# Altium schematic sheet [16] - DOC, POWER SEQUENCING.SchDoc
size A2; DocumentNumber: 16; SheetNumber: 16; SheetTotal: 18
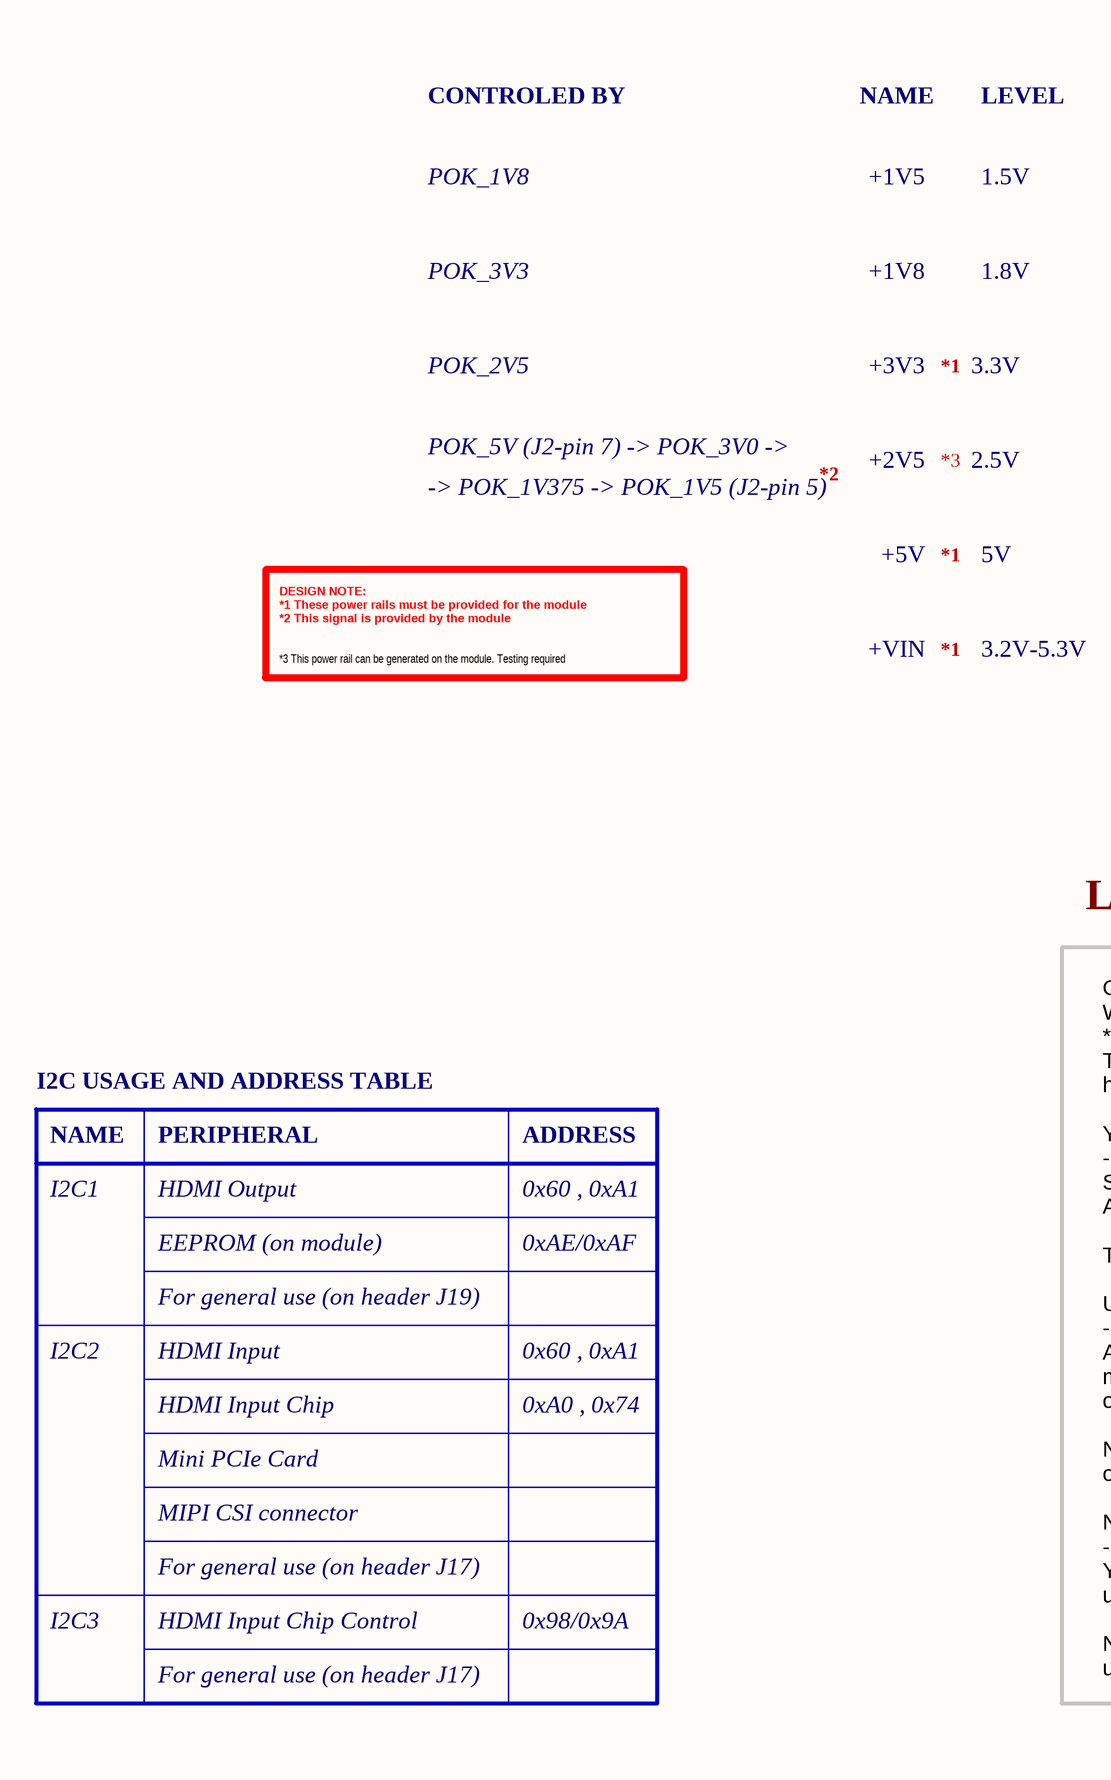
[diagram p0: [16] - DOC, POWER SEQUENCING.SchDoc, left]
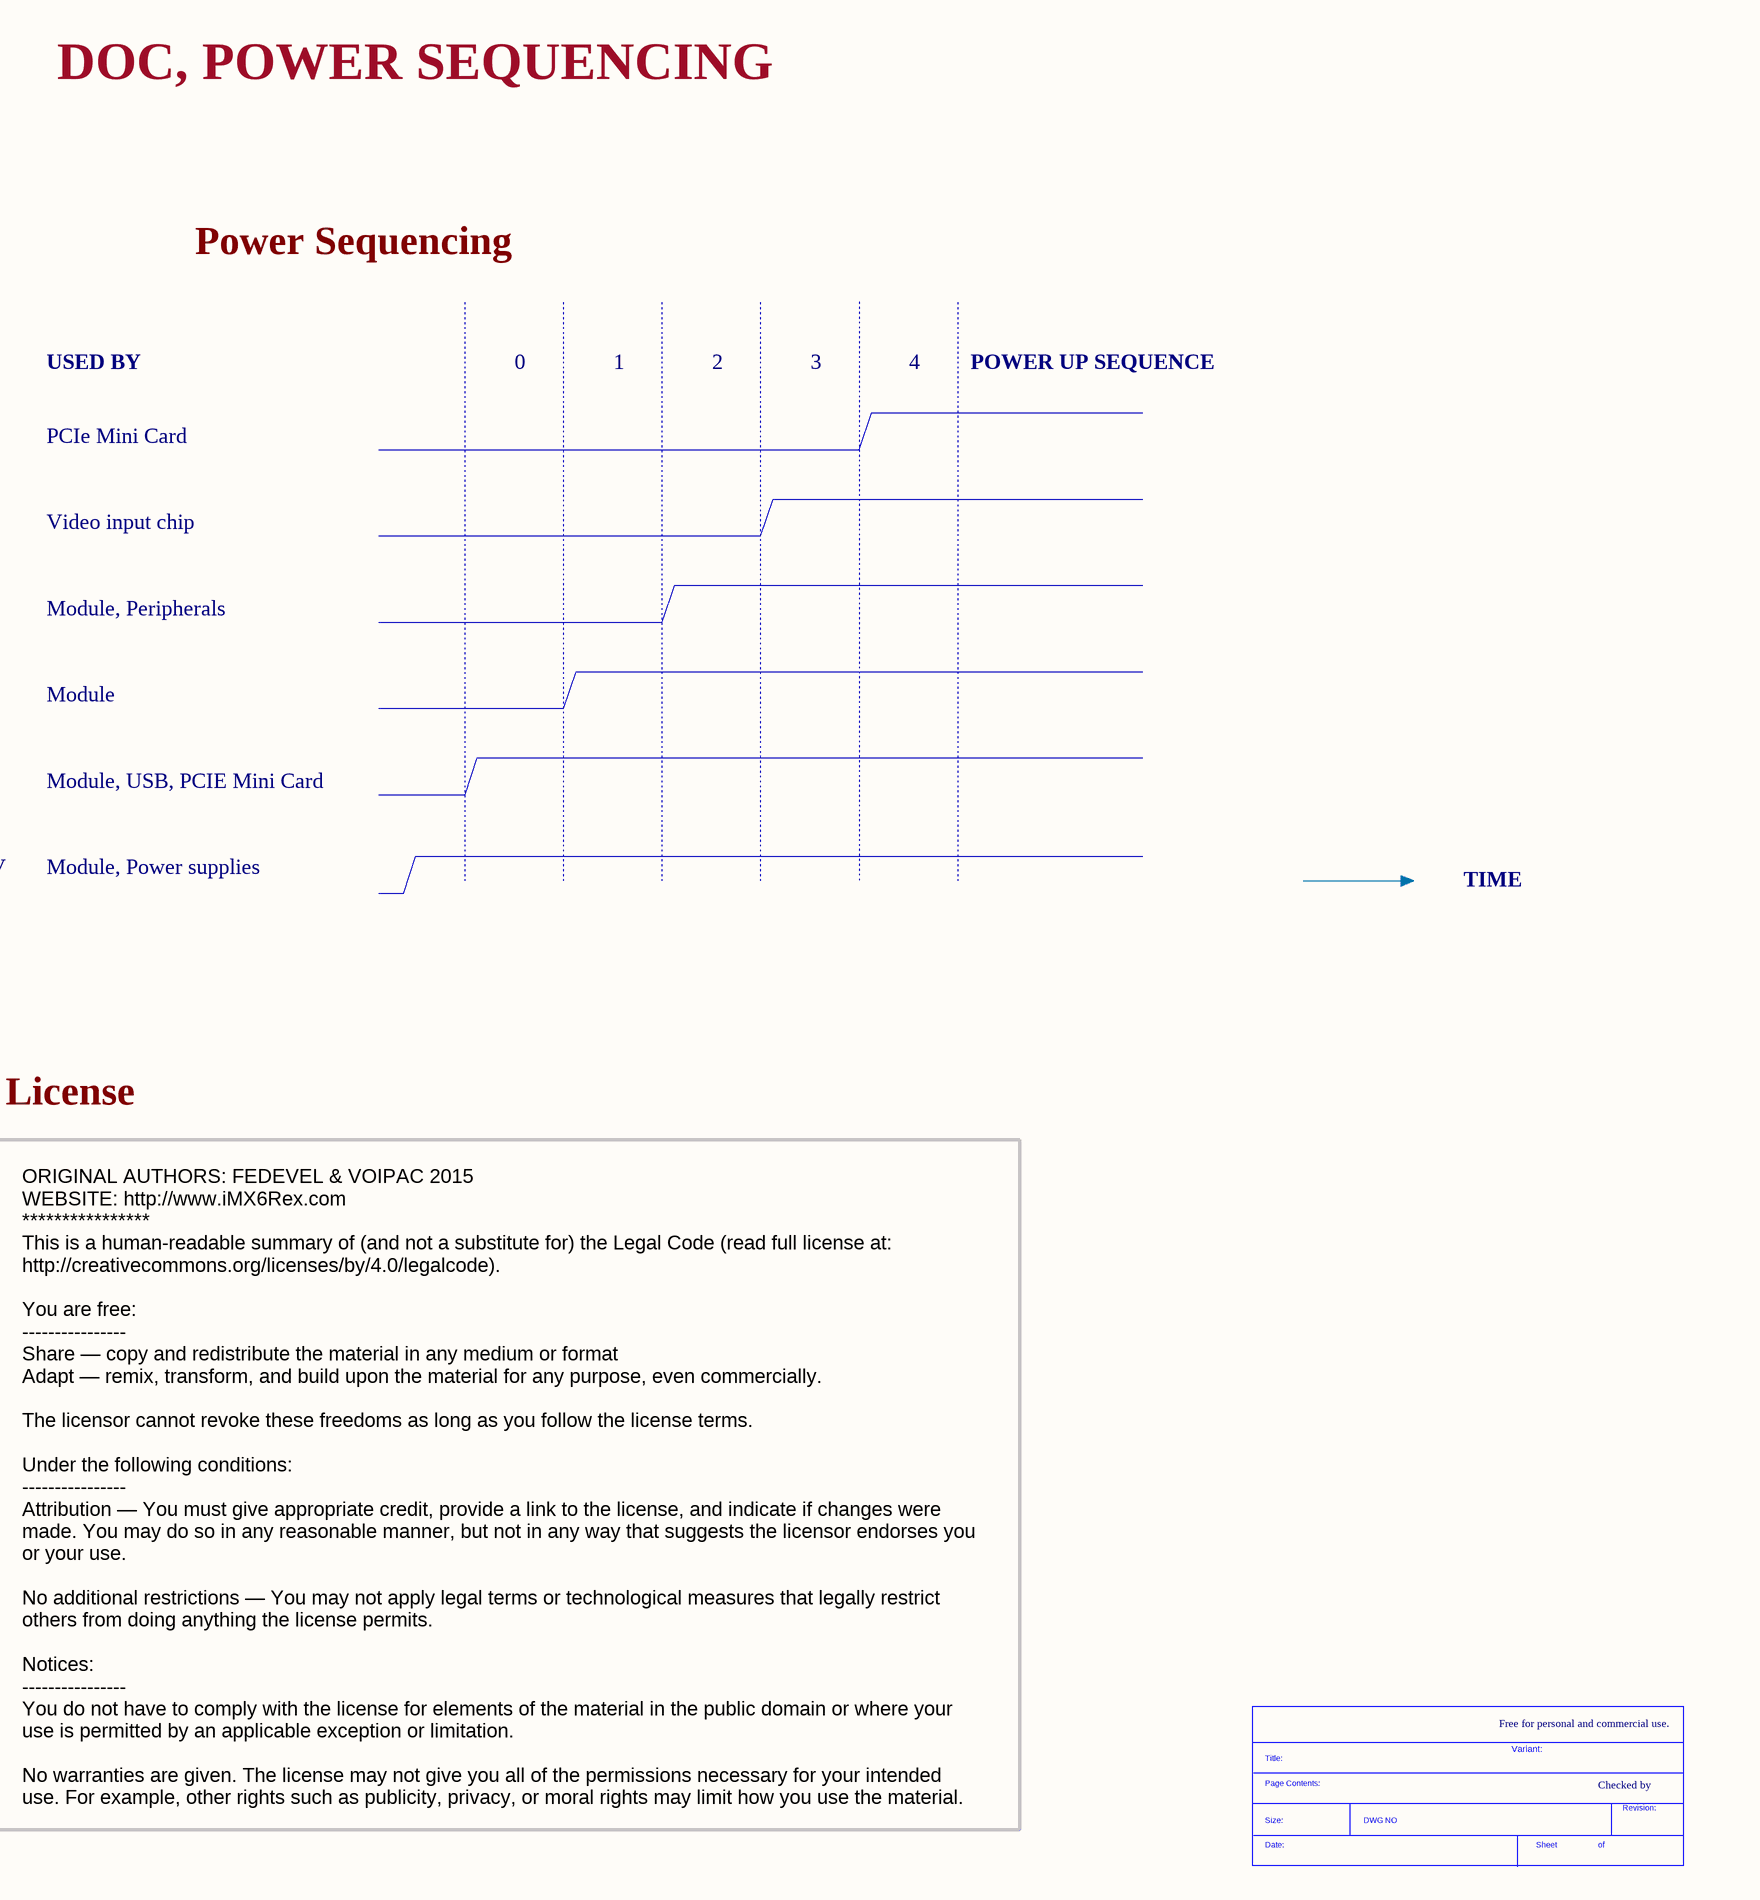
[diagram p1: [16] - DOC, POWER SEQUENCING.SchDoc, right]

## Parts
*  SDTitleBlock  (value not drawn)  (graphical)

## Notes on the sheet
- DOC, POWER SEQUENCING
- Power Sequencing
- CONTROLED BY
- NAME
- LEVEL
- USED BY
- 0
- 1
- 2
- 3
- 4
- POWER UP SEQUENCE
- POK_1V8
- +1V5
- 1.5V
- PCIe Mini Card
- POK_3V3
- +1V8
- 1.8V
- Video input chip
- POK_2V5
- +3V3
- *1
- 3.3V
- Module, Peripherals
- POK_5V (J2-pin 7) -> POK_3V0 ->
- *2
- *3
- -> POK_1V375 -> POK_1V5 (J2-pin 5)
- +2V5
- 2.5V
- Module
- +5V
- 5V
- Module, USB, PCIE Mini Card
- DESIGN NOTE:
  *1 These power rails must be provided for the module
  *2 This signal is provided by the module
- +VIN
- 3.2V-5.3V
- Module, Power supplies
- *3 This power rail can be generated on the module. Testing required
- TIME
- License
- I2C USAGE AND ADDRESS TABLE
- I2C1
- PERIPHERAL
- HDMI Output
- ADDRESS
- 0x60 , 0xA1
- EEPROM (on module)
- 0xAE/0xAF
- For general use (on header J19)
- I2C2
- HDMI Input
- Mini PCIe Card
- HDMI Input Chip
- 0xA0 , 0x74
- MIPI CSI connector
- For general use (on header J17)
- Free for personal and commercial use.
- I2C3
- HDMI Input Chip Control
- 0x98/0x9A
- Variant:
- Checked by
- ORIGINAL AUTHORS: FEDEVEL & VOIPAC 2015
  WEBSITE: http://www.iMX6Rex.com
  ****************
  This is a human-readable summary of (and not a substitute for) the Legal Code (read full license at:
  http://creativecommons.org/licenses/by/4.0/legalcode).
  You are free:
  ----------------
  Share — copy and redistribute the material in any medium or format
  Adapt — remix, transform, and build upon the material for any purpose, even commercially.
  The licensor cannot revoke these freedoms as long as you follow the license terms.
  Under the following conditions:
  ----------------
  Attribution — You must give appropriate credit, provide a link to the license, and indicate if changes were made. You may do so in any reasonable manner, but not in any way that suggests the licensor endorses you or your use.
  No additional restrictions — You may not apply legal terms or technological measures that legally restrict others from doing anything the license permits.
  Notices:
  ----------------
  You do not have to comply with the license for elements of the material in the public domain or where your use is permitted by an applicable exception or limitation.
  No warranties are given. The license may not give you all of the permissions necessary for your intended use. For example, other rights such as publicity, privacy, or moral rights may limit how you use the material.
- (in symbol SDTitleBlock) Title:; Page Contents:; Revision:; Size:; DWG NO; Date:; Sheet; of